# EAGLE design board (EAGLE 9.6.2)
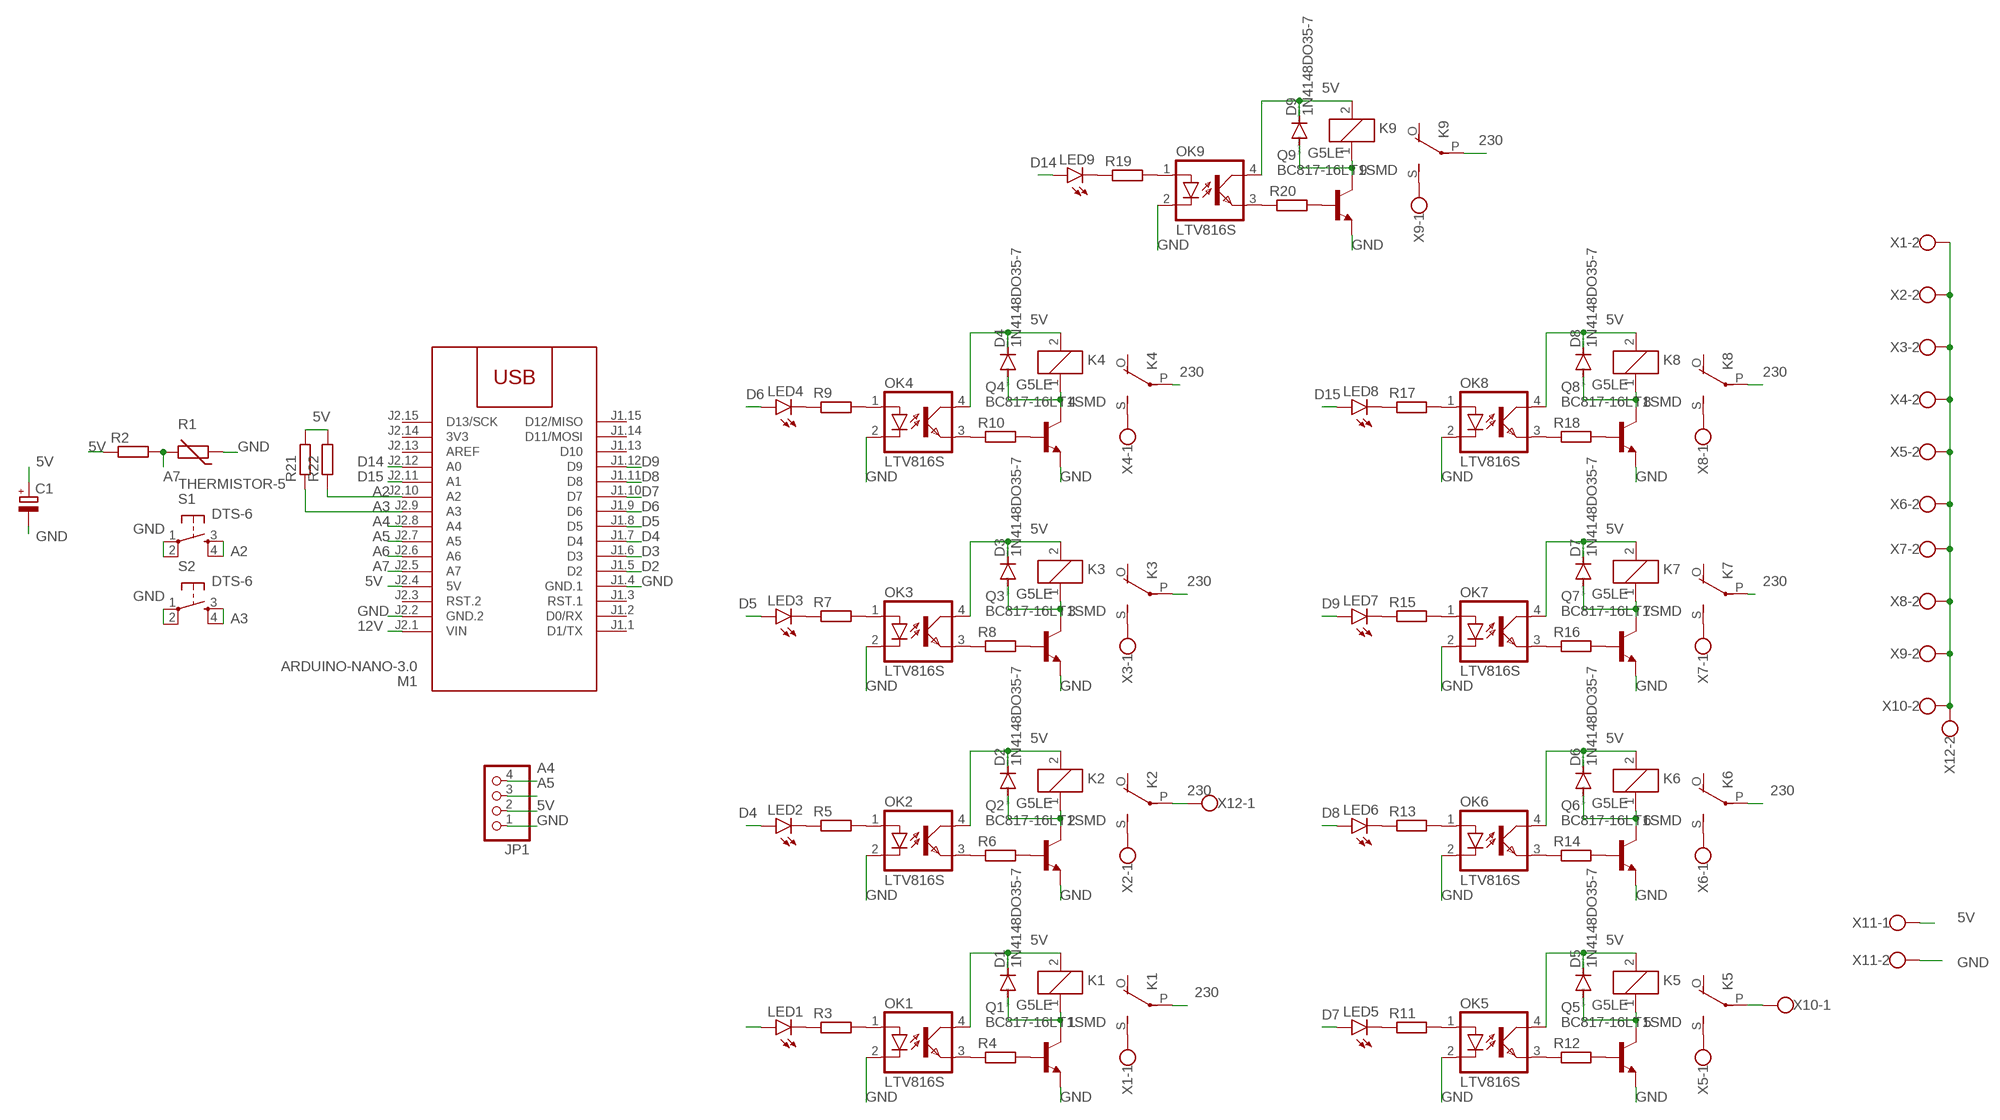
[diagram p0: schematic, sheet 1]

## Parts
C1  CPOL-EUB45181A  [B45181A]
D1  1N4148DO35-7  [DO35-7]
D2  1N4148DO35-7  [DO35-7]
D3  1N4148DO35-7  [DO35-7]
D4  1N4148DO35-7  [DO35-7]
D5  1N4148DO35-7  [DO35-7]
D6  1N4148DO35-7  [DO35-7]
D7  1N4148DO35-7  [DO35-7]
D8  1N4148DO35-7  [DO35-7]
D9  1N4148DO35-7  [DO35-7]
JP1  PINHD-1X4  [1X04]
K1  G5LE  [G5LE]
K2  G5LE  [G5LE]
K3  G5LE  [G5LE]
K4  G5LE  [G5LE]
K5  G5LE  [G5LE]
K6  G5LE  [G5LE]
K7  G5LE  [G5LE]
K8  G5LE  [G5LE]
K9  G5LE  [G5LE]
LED1  LED3MM  [LED3MM]
LED2  LED3MM  [LED3MM]
LED3  LED3MM  [LED3MM]
LED4  LED3MM  [LED3MM]
LED5  LED3MM  [LED3MM]
LED6  LED3MM  [LED3MM]
LED7  LED3MM  [LED3MM]
LED8  LED3MM  [LED3MM]
LED9  LED3MM  [LED3MM]
M1  ARDUINO-NANO-3.0  [ARDUINO-NANO-3.0]
OK1  LTV816S  [DIL4-SMD]
OK2  LTV816S  [DIL4-SMD]
OK3  LTV816S  [DIL4-SMD]
OK4  LTV816S  [DIL4-SMD]
OK5  LTV816S  [DIL4-SMD]
OK6  LTV816S  [DIL4-SMD]
OK7  LTV816S  [DIL4-SMD]
OK8  LTV816S  [DIL4-SMD]
OK9  LTV816S  [DIL4-SMD]
Q1  BC817-16LT1SMD  [SOT23-BEC]
Q2  BC817-16LT1SMD  [SOT23-BEC]
Q3  BC817-16LT1SMD  [SOT23-BEC]
Q4  BC817-16LT1SMD  [SOT23-BEC]
Q5  BC817-16LT1SMD  [SOT23-BEC]
Q6  BC817-16LT1SMD  [SOT23-BEC]
Q7  BC817-16LT1SMD  [SOT23-BEC]
Q8  BC817-16LT1SMD  [SOT23-BEC]
Q9  BC817-16LT1SMD  [SOT23-BEC]
R1  THERMISTOR-5  [R-5]
R2  R-EU_0207/10  [0207/10]
R3  R-EU_R1206  [R1206]
R4  R-EU_R1206  [R1206]
R5  R-EU_R1206  [R1206]
R6  R-EU_R1206  [R1206]
R7  R-EU_R1206  [R1206]
R8  R-EU_R1206  [R1206]
R9  R-EU_R1206  [R1206]
R10  R-EU_R1206  [R1206]
R11  R-EU_R1206  [R1206]
R12  R-EU_R1206  [R1206]
R13  R-EU_R1206  [R1206]
R14  R-EU_R1206  [R1206]
R15  R-EU_R1206  [R1206]
R16  R-EU_R1206  [R1206]
R17  R-EU_R1206  [R1206]
R18  R-EU_R1206  [R1206]
R19  R-EU_R1206  [R1206]
R20  R-EU_R1206  [R1206]
R21  R-EU_0207/10  [0207/10]
R22  R-EU_0207/10  [0207/10]
S1  DTS-6  [DTS-6]
S2  DTS-6  [DTS-6]
X1  W237-102  [W237-102]
X2  W237-102  [W237-102]
X3  W237-102  [W237-102]
X4  W237-102  [W237-102]
X5  W237-102  [W237-102]
X6  W237-102  [W237-102]
X7  W237-102  [W237-102]
X8  W237-102  [W237-102]
X9  W237-102  [W237-102]
X10  W237-102  [W237-102]
X11  W237-102  [W237-102]
X12  W237-102  [W237-102]

## Nets
1: D1.A K1.1 Q1.C
2: D2.A K2.1 Q2.C
3: D3.A K3.1 Q3.C
4: D4.A K4.1 Q4.C
5: D5.A K5.1 Q5.C
5V: C1.+ D1.C D2.C D3.C D4.C D5.C D6.C D7.C D8.C D9.C JP1.2 K1.2 K2.2 K3.2 K4.2 K5.2 K6.2 K7.2 K8.2 K9.2 M1.J2.4(5V) OK1.4(COL) OK2.4(COL) OK3.4(COL) OK4.4(COL) OK5.4(COL) OK6.4(COL) OK7.4(COL) OK8.4(COL) OK9.4(COL) R2.1 R21.2 R22.2 X11.1
6: D6.A K6.1 Q6.C
7: D7.A K7.1 Q7.C
8: D8.A K8.1 Q8.C
9: D9.A K9.1 Q9.C
12V: M1.J2.1(VIN)
230: K1.P(2:P) K2.P(2:P) K3.P(2:P) K4.P(2:P) K5.P(2:P) K6.P(2:P) K7.P(2:P) K8.P(2:P) K9.P(2:P) X10.1 X12.1
A2: M1.J2.10(A2) R22.1 S1.3 S1.4
A3: M1.J2.9(A3) R21.1 S2.3 S2.4
A4: JP1.4 M1.J2.8(A4)
A5: JP1.3 M1.J2.7(A5)
A6: M1.J2.6(A6)
A7: M1.J2.5(A7) R1.2 R2.2
D2: M1.J1.5(D2)
D3: LED1.A M1.J1.6(D3)
D4: LED2.A M1.J1.7(D4)
D5: LED3.A M1.J1.8(D5)
D6: LED4.A M1.J1.9(D6)
D7: LED5.A M1.J1.10(D7)
D8: LED6.A M1.J1.11(D8)
D9: LED7.A M1.J1.12(D9)
D14: LED9.A M1.J2.12(A0)
D15: LED8.A M1.J2.11(A1)
GND: C1.- JP1.1 M1.J1.4(GND.1) M1.J2.2(GND.2) OK1.2(C) OK2.2(C) OK3.2(C) OK4.2(C) OK5.2(C) OK6.2(C) OK7.2(C) OK8.2(C) OK9.2(C) Q1.E Q2.E Q3.E Q4.E Q5.E Q6.E Q7.E Q8.E Q9.E R1.1 S1.1 S1.2 S2.1 S2.2 X11.2
N$1: OK1.1(A) R3.2
N$2: LED1.K(C) R3.1
N$3: OK1.3(EMIT) R4.1
N$4: Q1.B R4.2
N$5: K1.S(2:S) X1.1
N$6: OK2.1(A) R5.2
N$7: LED2.K(C) R5.1
N$8: OK2.3(EMIT) R6.1
N$9: Q2.B R6.2
N$10: K2.S(2:S) X2.1
N$11: K3.S(2:S) X3.1
N$12: OK3.1(A) R7.2
N$13: LED3.K(C) R7.1
N$14: OK3.3(EMIT) R8.1
N$15: Q3.B R8.2
N$16: K4.S(2:S) X4.1
N$17: OK4.1(A) R9.2
N$18: LED4.K(C) R9.1
N$19: OK4.3(EMIT) R10.1
N$20: Q4.B R10.2
N$21: K5.S(2:S) X5.1
N$22: OK5.1(A) R11.2
N$23: LED5.K(C) R11.1
N$24: OK5.3(EMIT) R12.1
N$25: Q5.B R12.2
N$26: K6.S(2:S) X6.1
N$27: OK6.1(A) R13.2
N$28: LED6.K(C) R13.1
N$29: OK6.3(EMIT) R14.1
N$30: Q6.B R14.2
N$31: K7.S(2:S) X7.1
N$32: OK7.1(A) R15.2
N$33: LED7.K(C) R15.1
N$34: OK7.3(EMIT) R16.1
N$35: Q7.B R16.2
N$36: K8.S(2:S) X8.1
N$37: OK8.1(A) R17.2
N$38: LED8.K(C) R17.1
N$39: OK8.3(EMIT) R18.1
N$40: Q8.B R18.2
N$41: K9.S(2:S) X9.1
N$42: OK9.1(A) R19.2
N$43: LED9.K(C) R19.1
N$44: OK9.3(EMIT) R20.1
N$45: Q9.B R20.2
N$46: X1.2 X2.2 X3.2 X4.2 X5.2 X6.2 X7.2 X8.2 X9.2 X10.2 X12.2
Unconnected: K1.O(2:O) K2.O(2:O) K3.O(2:O) K4.O(2:O) K5.O(2:O) K6.O(2:O) K7.O(2:O) K8.O(2:O) K9.O(2:O) M1.J1.1(D1/TX) M1.J1.2(D0/RX) M1.J1.3(RST.1) M1.J1.13(D10) M1.J1.14(D11/MOSI) M1.J1.15(D12/MISO) M1.J2.3(RST.2) M1.J2.13(AREF) M1.J2.15(D13/SCK)

## Power pins joined to a net without a drawn wire
3V3: M1.J2.14(3V3)

## Library data of the parts
C1 = rcl:CPOL-EU: POLARIZED CAPACITOR, European symbol; SPICEPREFIX: C
D1-D9 = diode:1N4148: DIODE high speed (Philips)
JP1 = pinhead:PINHD-1X4: PIN HEADER
K1-K9 = relay:G5LE: RELAY 1 x switch, 10 A/120 V AC, 8 A/30 V DC, Omron; OC_FARNELL: unknown; OC_NEWARK: unknown
LED1-LED9 = led:LED: LED OSRAM: - CHIPLED LG R971, LG N971, LY N971, LG Q971, LY Q971, LO R971, LY R971 LH N974, LH R974 LS Q976, LO Q976, LY Q976 LO Q996 - Hyper CHIPLED LW Q18S LB Q993, LB Q99A, LB R99A - SideLED LS A670, LO A670, LY A670, LG A670, LP A670 LB A673, LV A673, LT A673, LW A673 LH A674 LY A675 LS A676, LA A676, LO A676, LY A676, LW A676 LS A679, LY A679, LG A679 - Hyper Micro SIDELED® LS Y876, LA Y876, LO Y876, LY Y876 LT Y87S - SmartLED LW L88C, LW L88S LB L89C, LB L89S, LG L890 LS L89K, LO L89K, LY L89K LS L896, LA L896, LO L896, LY L896 - TOPLED LS T670, LO T670, LY T670, LG T670, LP T670 LSG T670, LSP T670, LSY T670, LOP T670, LYG T670 LG T671, LOG T671, LSG T671 LB T673, LV T673, LT T673, LW T673 LH T674 LS T676, LA T676, LO T676, LY T676, LB T676, LH T676, LSB T676, LW T676 LB T67C, LV T67C, LT T67C, LS T67K, LO T67K, LY T67K, LW E67C LS E67B, LA E67B, LO E67B, LY E67B, LB E67C, LV E67C, LT E67C LW T67C LS T679, LY T679, LG T679 LS T770, LO T770, LY T770, LG T770, LP T770 LB T773, LV T773, LT T773, LW T773 LH T774 LS E675, LA E675, LY E675, LS T675 LS T776, LA T776, LO T776, LY T776, LB T776 LHGB T686 LT T68C, LB T68C - Hyper Mini TOPLED® LB M676 - Mini TOPLED Santana® LG M470 LS M47K, LO M47K, LY M47K Source: http://www.osram.convergy.de LUXEON: - LUMILED® LXK2-PW12-R00, LXK2-PW12-S00, LXK2-PW14-U00, LXK2-PW14-V00 LXK2-PM12-R00, LXK2-PM12-S00, LXK2-PM14-U00 LXK2-PE12-Q00, LXK2-PE12-R00, LXK2-PE12-S00, LXK2-PE14-T00, LXK2-PE14-U00 LXK2-PB12-K00, LXK2-PB12-L00, LXK2-PB12-M00, LXK2-PB14-N00, LXK2-PB14-P00, LXK2-PB14-Q00 LXK2-PR12-L00, LXK2-PR12-M00, LXK2-PR14-Q00, LXK2-PR14-R00 LXK2-PD12-Q00, LXK2-PD12-R00, LXK2-PD12-S00 LXK2-PH12-R00, LXK2-PH12-S00 LXK2-PL12-P00, LXK2-PL12-Q00, LXK2-PL12-R00 Source: www.luxeon.com KINGBRIGHT: KA-3528ASYC Source: www.kingbright.com
M1 = diy-modules:ARDUINO-NANO-3.0: Arduino Nano 3.0 and compatible devices More details available here: https://www.arduino.cc/en/Main/ArduinoBoardNano Click here to find device on ebay.com <http://www.ebay.com/sch/arduino+nano>
OK1-OK9 = optocoupler:LTV816: OPTO COUPLER Source: LITEON, LTV816.pdf
Q1-Q9 = transistor-npn:BC817*: NPN Transistor
R1 = varistor:THERMISTOR: THERMISTOR
R2-R22 = rcl:R-EU_: RESISTOR, European symbol; SPICEPREFIX: R
S1 S2 = switch-tact:DTS-6
X1-X12 = con-wago-500:W237-102: WAGO SCREW CLAMP; MPN: 237-102; OC_FARNELL: unknown; OC_NEWARK: 70K9898

## Board
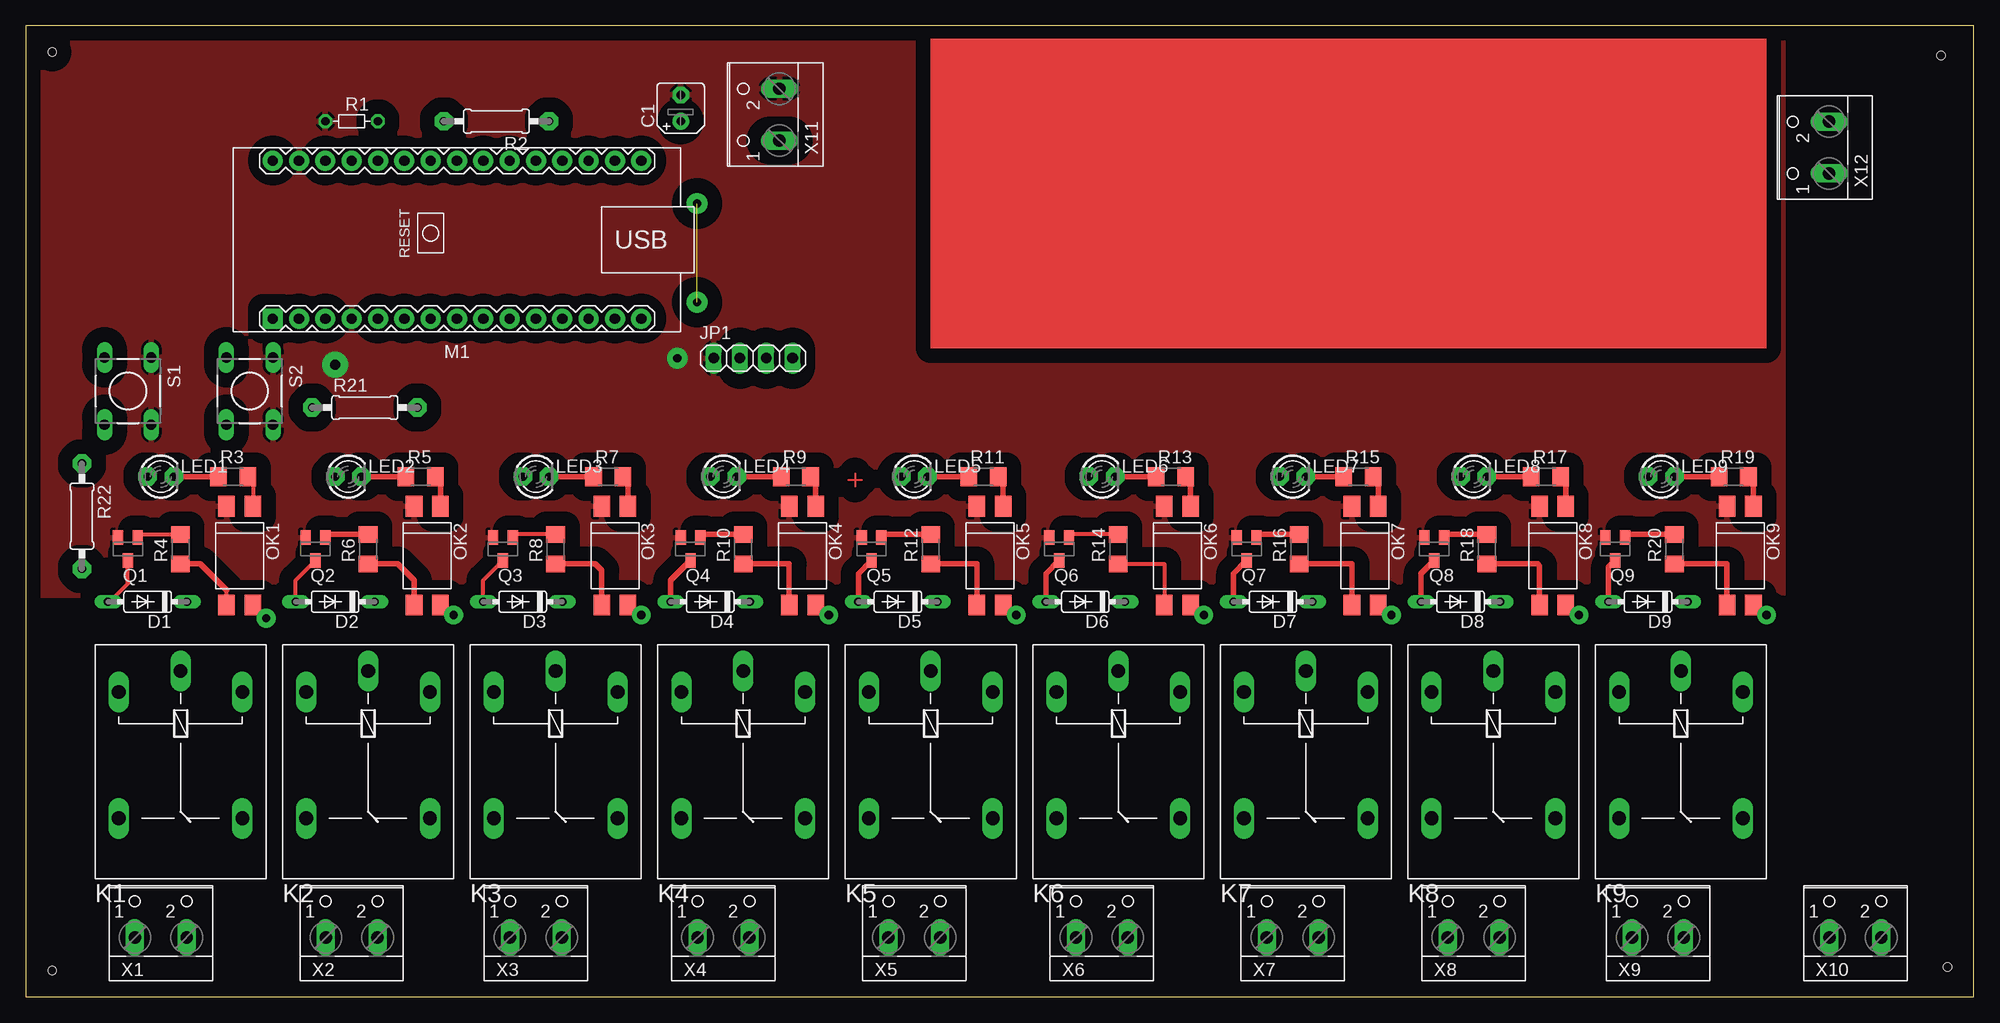
[diagram p1: board, top side]
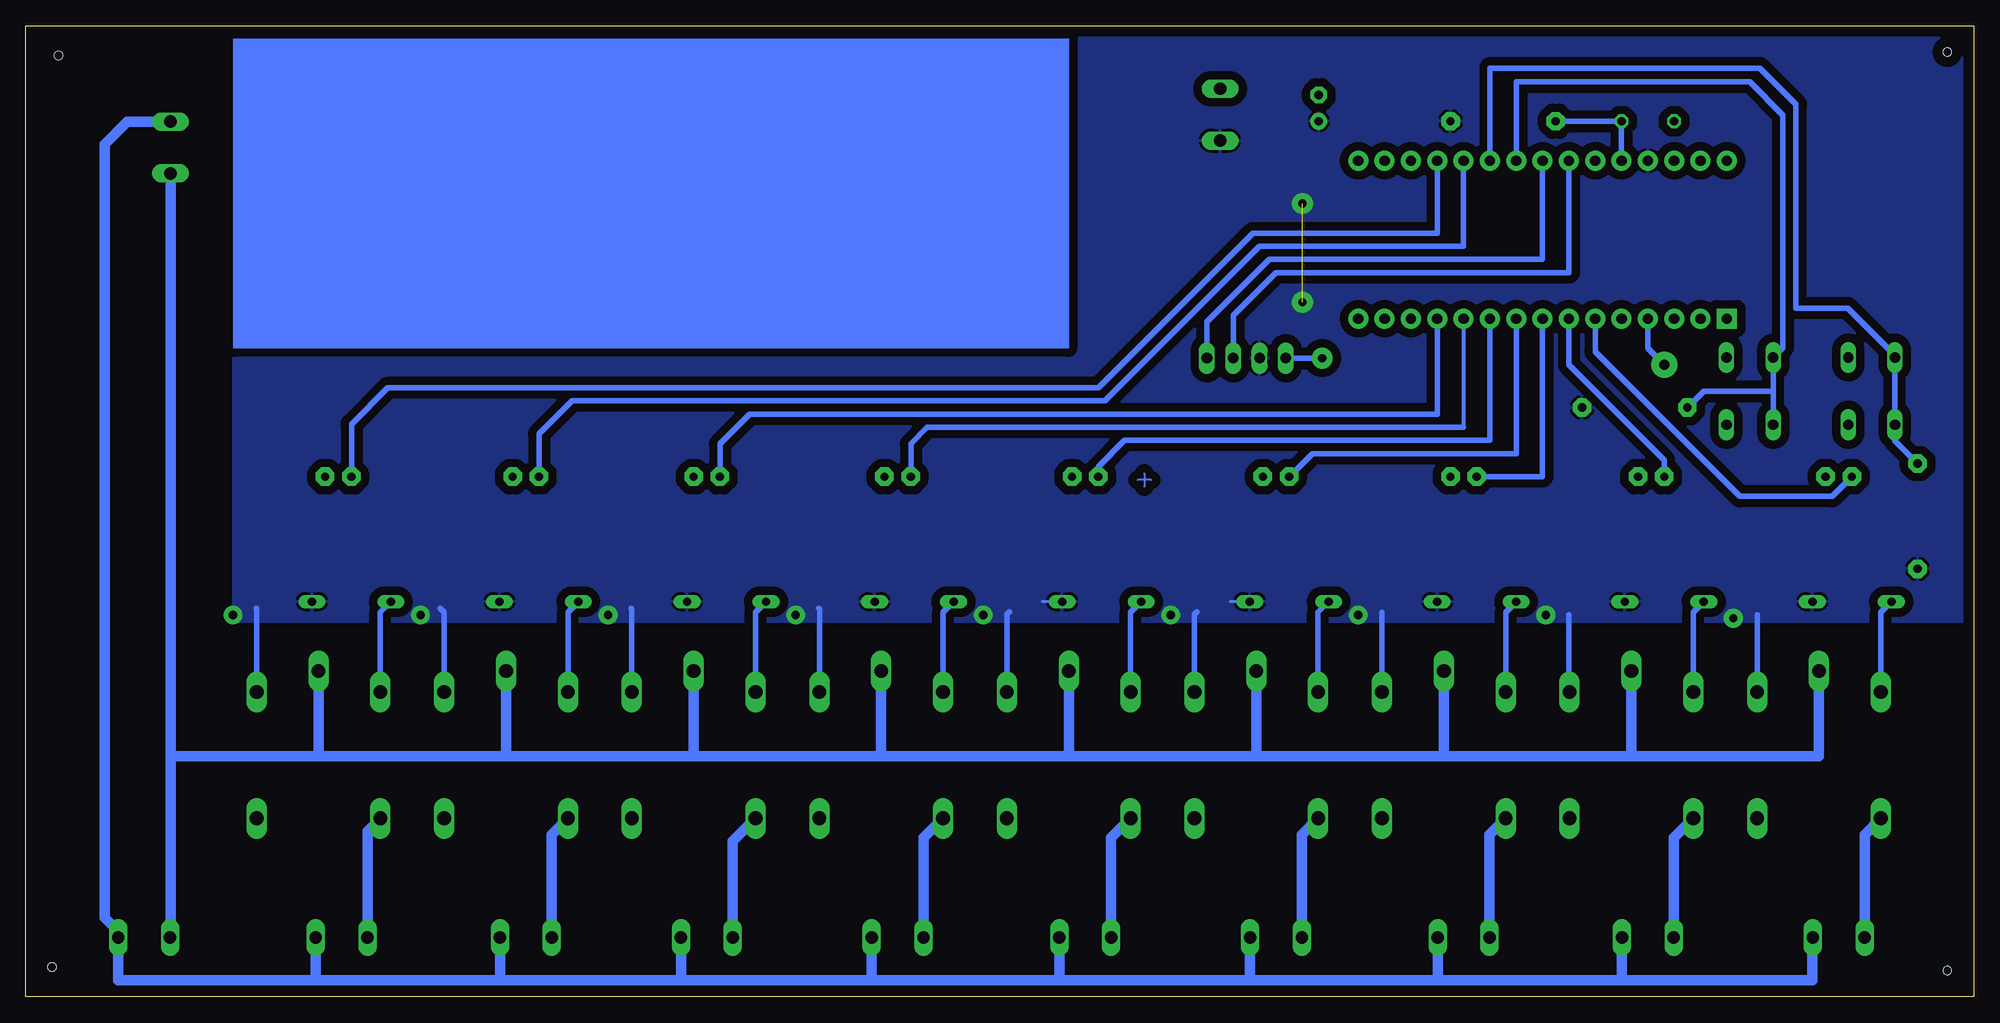
[diagram p2: board, bottom side, seen from below]

Size 187.94 x 93.65 mm. Coordinates in mm from the lower left corner, seen from the top.
Outline: 0,0 187.94,0 187.94,93.65 0,93.65 0,0
Copper layers (1*16): Top 0.035mm / dielectric 1.5mm / Bottom 0.035mm
Design rules "default": minimum track width 6mil, minimum drill 0.35mm, track to track 6mil, track to pad 6mil, pad to pad 6mil, via to via 6mil, smd to smd 6mil, copper to edge 40mil, drill to drill 6mil, minimum pad ring 10mil, minimum via ring 8mil, stop-mask expansion 4mil, vias tented up to drill 0mil, thermal gap 10mil
Holes 0.8 mm at 2.54,91.12 184.78,90.81 185.42,2.86 2.54,2.54

### Footprints (pad centres in the part's own frame; a part is rotated, then mirrored left to right if it is on the bottom)
B45181A = drill 0.813 pad 1.6: + -1.27,0 | drill 0.813 pad 1.6 octagon: - 1.27,0
DO35-7 = drill 0.813 long: A 3.81,0; C -3.81,0
1X04 = drill 1.016 long: 1 -3.81,0; 2 -1.27,0; 3 1.27,0; 4 3.81,0
G5LE = drill 1.321 long: 1 -7.493,-5.969; 2 -7.493,5.969; O 4.699,5.969; P -9.525,0; S 4.699,-5.969
LED3MM = drill 0.8 pad 1.778 octagon: A -1.27,0; K 1.27,0
ARDUINO-NANO-3.0 = drill 1 pad 1.93 square: J1.1 17.78,7.62 | drill 1 pad 1.93: J1.2 15.24,7.62; J1.3 12.7,7.62; J1.4 10.16,7.62; J1.5 7.62,7.62; J1.6 5.08,7.62; J1.7 2.54,7.62; J1.8 0,7.62; J1.9 -2.54,7.62; J1.10 -5.08,7.62; J1.11 -7.62,7.62; J1.12 -10.16,7.62; J1.13 -12.7,7.62; J1.14 -15.24,7.62; J1.15 -17.78,7.62; J2.1 17.78,-7.62; J2.2 15.24,-7.62; J2.3 12.7,-7.62; J2.4 10.16,-7.62; J2.5 7.62,-7.62; J2.6 5.08,-7.62; J2.7 2.54,-7.62; J2.8 0,-7.62; J2.9 -2.54,-7.62; J2.10 -5.08,-7.62; J2.11 -7.62,-7.62; J2.12 -10.16,-7.62; J2.13 -12.7,-7.62; J2.14 -15.24,-7.62; J2.15 -17.78,-7.62
DIL4-SMD = smd 1.6 x 2: 1 -1.27,-4.77; 2 1.27,-4.77; 3 1.27,4.77; 4 -1.27,4.77
SOT23-BEC = smd 1 x 1.4: B -0.95,-1.1; C 0,1.1; E 0.95,-1.1
R-5 = drill 0.813 octagon: 1 -2.54,0; 2 2.54,0
0207/10 = drill 0.8 pad 1.778 octagon: 1 -5.08,0; 2 5.08,0
R1206 = smd 1.6 x 1.803: 1 -1.422,0; 2 1.422,0
DTS-6 = drill 1 long: 1 -3.25,2.25; 2 3.25,2.25; 3 -3.25,-2.25; 4 3.25,-2.25
W237-102 = drill 1.194 long: 1 -2.5,-1.27; 2 2.5,-1.27

### Placement (x,y rotation side)
C1  63.18,85.72 90 top
D1  11.75,38.1 180 top
D2  29.84,38.1 180 top
D3  47.94,38.1 180 top
D4  66.04,38.1 180 top
D5  84.14,38.1 180 top
D6  102.23,38.1 180 top
D7  120.33,38.1 180 top
D8  138.43,38.1 180 top
D9  156.53,38.1 180 top
JP1  70.17,61.59 0 top
K1  14.92,21.91 270 top
K2  33.02,21.91 270 top
K3  51.12,21.91 270 top
K4  69.22,21.91 270 top
K5  87.31,21.91 270 top
K6  105.41,21.91 270 top
K7  123.51,21.91 270 top
K8  141.6,21.91 270 top
K9  159.7,21.91 270 top
LED1  13.02,50.16 0 top
LED2  31.11,50.16 0 top
LED3  49.21,50.16 0 top
LED4  67.31,50.16 0 top
LED5  85.72,50.16 0 top
LED6  103.82,50.16 0 top
LED7  122.24,50.16 0 top
LED8  139.7,50.16 0 top
LED9  157.8,50.16 0 top
M1  41.59,73.03 180 top
OK1  20.64,42.55 180 top
OK2  38.73,42.55 180 top
OK3  56.83,42.55 180 top
OK4  74.93,42.55 180 top
OK5  93.03,42.55 180 top
OK6  111.12,42.55 180 top
OK7  129.22,42.55 180 top
OK8  147.32,42.55 180 top
OK9  165.42,42.55 180 top
Q1  9.84,43.18 180 top
Q2  27.94,43.18 180 top
Q3  46.04,43.18 180 top
Q4  64.14,43.18 180 top
Q5  81.6,43.18 180 top
Q6  99.69,43.18 180 top
Q7  117.79,43.18 180 top
Q8  135.89,43.18 180 top
Q9  153.35,43.18 180 top
R1  31.43,84.45 0 top
R2  45.4,84.45 180 top
R3  20,50.16 0 top
R4  14.92,43.18 90 top
R5  38.1,50.16 0 top
R6  33.02,43.18 90 top
R7  56.2,50.16 0 top
R8  51.12,43.18 90 top
R9  74.3,50.16 0 top
R10  69.22,43.18 90 top
R11  92.39,50.16 0 top
R12  87.31,43.18 90 top
R13  110.49,50.16 0 top
R14  105.41,43.18 90 top
R15  128.59,50.16 0 top
R16  122.87,43.18 90 top
R17  146.69,50.16 0 top
R18  140.97,43.18 90 top
R19  164.78,50.16 0 top
R20  159.07,43.18 90 top
R21  32.7,56.83 0 top
R22  5.4,46.35 270 top
S1  9.84,58.42 270 top
S2  21.59,58.42 270 top
X1  13.02,6.99 0 top
X2  31.43,6.99 0 top
X3  49.21,6.99 0 top
X4  67.31,6.99 0 top
X5  85.72,6.99 0 top
X6  103.82,6.99 0 top
X7  122.24,6.99 0 top
X8  139.7,6.99 0 top
X9  157.48,6.99 0 top
X10  176.53,6.99 0 top
X11  71.44,85.09 90 top
X12  172.72,81.92 90 top

### Tracks (layer width: path | path; a pad name or v marks a point on that pad's centre or on a via)
1
  Top 0.406: D1.A 7.94,37.95 9.84,39.86 Q1.C
  Bottom 0.305: D1.A 8.01,38.1
  Bottom 0.508: K1.1 8.95,37.08 D1.A
2
  Top 0.406: D2.A 26.04,40.17 Q2.C
  Bottom 0.508: K2.1 27.05,37.08 D2.A
3
  Top 0.406: D3.A 44.13,40.17 Q3.C
  Bottom 0.508: K3.1 45.15,37.08 D3.A
4
  Top 0.508: D4.A 62.23,40.17 Q4.C
  Bottom 0.508: K4.1 63.25,37.08 D4.A
5
  Top 0.508: D5.A 80.33,40.81 Q5.C
  Bottom 0.508: K5.1 81.34,37.08 D5.A
5V  (via drill 0.8 pad 1.8, 0.8 pad 2)  (1 unrouted)
  Top 0.305: OK8.4 148.91,37.77
  Top 0.406: OK2.4 40.33,37.77 v41.27,36.83 | OK3.4 58.43,37.77 v59.37,36.83 | OK4.4 76.53,37.77 v77.47,36.83 | OK5.4 94.62,37.77 v95.57,36.83 | OK6.4 112.72,37.77 v113.67,36.83 | v131.76,36.83 130.82,37.77 OK7.4 | 148.91,37.77 v149.86,36.83 | OK9.4 167.01,37.77 v167.96,36.83 | OK1.4 v23.18,36.51
  Bottom 0.305: D4.C 71.75,38.1 | D5.C 89.85,38.1
  Bottom 0.406: K2.2 39.05,29.46
  Bottom 0.508: K1.2 20.89,36.83 | 39.05,29.46 39.05,36.83 | K3.2 57.09,37.08 | K4.2 75.18,36.89 74.93,37.15 | K5.2 93.28,36.89 93.03,37.15 | K6.2 111.38,37.4 111.44,37.47 | K7.2 129.48,37.4 129.54,37.47 | K8.2 147.57,37.08 147.96,37.47 | K9.2 165.67,37.4 165.74,37.47
  other vias: 64.77,76.52 64.77,66.99
  pour Bottom (isolate 0.813): 0,93.66 167.96,93.66 167.96,36.2 0,36.2
6
  Top 0.508: D6.A 98.42,40.81 Q6.C
  Bottom 0.508: K6.1 99.44,37.08 D6.A
7
  Top 0.508: D7.A 116.52,40.81 Q7.C
  Bottom 0.508: K7.1 117.54,37.08 D7.A
8
  Top 0.508: D8.A 134.62,40.81 Q8.C
  Bottom 0.508: K8.1 135.64,37.08 D8.A
9
  Top 0.508: D9.A 152.72,41.45 Q9.C
  Bottom 0.508: K9.1 153.73,37.08 D9.A
230
  Bottom 1.016: K1.P 14.92,23.18 33.02,23.18 | 33.02,23.18 51.12,23.18 | 51.12,23.18 69.22,23.18 | 69.22,23.18 87.31,23.18 | 87.31,23.18 91.12,23.18 105.41,23.18 | 105.41,23.18 110.17,23.18 123.51,23.18 | 123.51,23.18 141.6,23.18 | 141.6,23.18 159.7,23.18 | K2.P 33.02,23.18 | K3.P 51.12,23.18 | K4.P 69.22,23.18 | K6.P 105.41,23.18 | K7.P 123.51,23.18 | K8.P 141.6,23.18 | K9.P 159.7,23.18 | 159.7,23.18 173.95,23.18 | X10.1 173.95,5.79 173.95,23.18 | K5.P 87.31,23.18 | X12.1 173.95,79.38 173.95,23.18
A2
  Bottom 0.508: M1.J2.10 46.67,89.57 20.64,89.57 17.14,86.08 17.14,66.43 12.14,66.43 7.59,61.88 S1.3 S1.4 7.59,53.63 R22.1
A3
  Bottom 0.508: M1.J2.9 44.13,88.27 21.62,88.27 18.39,85.03 18.39,62.62 S2.3 19.34,58.42 | S2.4 19.34,58.42 | R21.1 26.04,58.42 19.34,58.42
A4
  Bottom 0.508: M1.J2.8 41.59,71.12 67.94,71.12 73.98,65.09 JP1.4
A5
  Bottom 0.508: M1.J2.7 39.05,69.85 67.31,69.85 71.44,65.72 JP1.3
A7
  Bottom 0.508: M1.J2.5 R1.2 R2.2
D3
  Bottom 0.508: M1.J1.6 36.51,62.23 22.54,48.26 13.65,48.26 LED1.A
D4
  Bottom 0.508: M1.J1.7 39.05,60.96 29.84,51.75 LED2.A
D5
  Bottom 0.508: M1.J1.8 41.59,50.16 LED3.A
D6
  Bottom 0.508: M1.J1.9 44.13,52.39 63.82,52.39 LED4.A
D7
  Bottom 0.508: M1.J1.10 46.67,53.66 81.92,53.66 84.45,51.12 LED5.A
D8
  Bottom 0.406: M1.J1.11 49.21,54.93
  Bottom 0.508: 49.21,54.93 100.97,54.93 102.55,53.34 LED6.A
D9
  Bottom 0.508: M1.J1.12 51.75,56.2 118.11,56.2 120.97,53.34 LED7.A
D14
  Bottom 0.406: 51.75,80.01 M1.J2.12
  Bottom 0.508: M1.J2.12 51.75,73.66 69.53,73.66 84.45,58.74 153.03,58.74 156.53,55.24 LED9.A
D15
  Bottom 0.406: 49.21,80.01 M1.J2.11
  Bottom 0.508: M1.J2.11 49.21,72.39 68.9,72.39 83.82,57.47 135.25,57.47 138.43,54.29 LED8.A
GND  (via drill 0.8 pad 2, 1 pad 2.5)
  Bottom 0.508: v29.84,60.96 31.43,62.55 M1.J1.4 | JP1.1 v62.87,61.59
  pour Top (isolate 1.422): 0,93.66 169.54,93.66 169.54,38.73 0,38.73
N$1
  Top 0.305: R3.2 21.91,49.68
  Top 0.406: 21.91,49.68 OK1.1
N$2
  Top 0.508: LED1.K R3.1
N$3
  Top 0.406: OK1.3 19.37,39.22
  Top 0.508: R4.1 16.83,41.76 19.37,39.22
N$4
  Top 0.305: Q1.B 11.11,44.6
  Top 0.406: 11.11,44.6 R4.2
N$5
  Bottom 1.016: K1.S 10.52,15.64 X1.1
N$6
  Top 0.305: R5.2 40.01,49.68
  Top 0.508: 40.01,49.68 OK2.1
N$7
  Top 0.508: LED2.K R5.1
N$8
  Top 0.508: R6.1 35.88,41.76 37.47,40.17 OK2.3
N$9
  Top 0.305: Q2.B 29.21,44.6
  Top 0.508: 29.21,44.6 R6.2
N$10
  Bottom 1.016: K2.S 28.93,15.33 X2.1
N$11
  Bottom 1.016: K3.S 46.71,15.64 X3.1
N$12
  Top 0.305: R7.2 58.1,49.68
  Top 0.508: 58.1,49.68 OK3.1
N$13
  Top 0.508: LED3.K R7.1
N$14
  Top 0.508: R8.1 54.93,41.76 55.56,41.12 OK3.3
N$15
  Top 0.305: 47.31,44.6 Q3.B
  Top 0.406: R8.2 47.31,44.6
N$16
  Bottom 1.016: K4.S 64.81,15.64 X4.1
N$17
  Top 0.305: R9.2 76.2,49.68
  Top 0.508: 76.2,49.68 OK4.1
N$18
  Top 0.508: LED4.K R9.1
N$19
  Top 0.508: R10.1 73.66,41.76 OK4.3
N$20
  Top 0.305: 65.41,44.6 Q4.B
  Top 0.508: R10.2 65.41,44.6
N$21
  Bottom 1.016: K5.S 83.22,15.33 X5.1
N$22
  Top 0.305: R11.2 94.3,49.68 | OK5.1 94.3,46.99
  Top 0.508: 94.3,49.68 OK5.1
N$23
  Top 0.508: LED5.K R11.1
N$24
  Top 0.508: OK5.3 91.76,41.76 R12.1
N$25
  Top 0.305: 82.87,44.6 Q5.B
  Top 0.508: R12.2 82.87,44.6
N$26
  Bottom 1.016: K6.S 101.32,15.33 X6.1
N$27
  Top 0.305: R13.2 112.39,49.68
  Top 0.508: 112.39,49.68 OK6.1
N$28
  Top 0.508: LED6.K R13.1
N$29
  Top 0.406: R14.1 109.86,41.76 OK6.3
N$30
  Top 0.305: 100.97,44.6 Q6.B
  Top 0.406: R14.2 100.97,44.6
N$31
  Bottom 1.016: K7.S 119.74,15.01 X7.1
N$32
  Top 0.305: R15.2 130.49,49.68
  Top 0.508: 130.49,49.68 OK7.1
N$33
  Top 0.508: LED7.K R15.1
N$34
  Top 0.508: R16.1 127.95,41.76 OK7.3
N$35
  Top 0.305: 119.06,44.6 Q7.B
  Top 0.508: R16.2 119.06,44.6
N$36
  Bottom 1.016: K8.S 137.2,15.64 X8.1
N$37
  Top 0.305: R17.2 148.59,49.68
  Top 0.508: 148.59,49.68 OK8.1
N$38
  Top 0.508: LED8.K R17.1
N$39
  Top 0.406: 146.05,41.59 145.88,41.76
  Top 0.508: R18.1 145.88,41.76 | 146.05,41.59 OK8.3
N$40
  Top 0.305: 137.16,44.6 Q8.B
  Top 0.508: R18.2 137.16,44.6
N$41
  Bottom 1.016: K9.S 154.98,15.96 X9.1
N$42
  Top 0.305: R19.2 166.69,49.68
  Top 0.508: 166.69,49.68 OK9.1
N$43
  Top 0.508: LED9.K R19.1
N$44
  Top 0.508: R20.1 164.15,41.76 OK9.3
N$45
  Top 0.305: 154.62,44.6 Q9.B
  Top 0.508: R20.2 154.62,44.6
N$46
  Bottom 1.016: 33.97,1.59 15.56,1.59 15.56,5.67 X1.2 | 33.97,1.59 51.75,1.59 | 51.75,1.59 69.85,1.59 | 69.85,1.59 88.27,1.59 | 88.27,1.59 106.36,1.59 | 106.36,1.59 124.78,1.59 | 124.78,1.59 142.24,1.59 | 142.24,1.59 160.02,1.59 | 160.02,1.59 179.03,1.59 X10.2 179.03,6.31 180.34,7.62 180.34,82.23 178.16,84.42 X12.2 | X2.2 33.93,1.63 33.97,1.59 | X3.2 51.71,1.63 51.75,1.59 | X4.2 69.81,1.63 69.85,1.59 | X5.2 88.22,1.63 88.27,1.59 | X6.2 106.32,1.63 106.36,1.59 | X7.2 124.74,1.63 124.78,1.59 | X8.2 142.2,1.63 142.24,1.59 | X9.2 159.98,1.63 160.02,1.59
N$47
  Bottom 0.2: 79.38,49.85 80.64,49.85
N$48
  Bottom 0.2: 80.01,50.48 80.01,49.21
N$49
  Top 0.2: 80.01,50.48 80.01,49.21
N$50
  Top 0.2: 79.38,49.85 80.64,49.85
(copper drawn outside any net)
  shapes: Bottom area x1, Top area x1